# Altium schematic sheet AVR128DB48_Curiosity_Nano_Target_MCU.SchDoc
size A3; SheetTitle: Target MCU; CompanyName: Microchip Technology Inc.; Organization: Microchip Technology; Address1: 2355 West Chandler Blvd.; Address2: Chandler, AZ  85224; Address4: USA; SheetNumber: 2; SheetTotal: 4; Time: Time
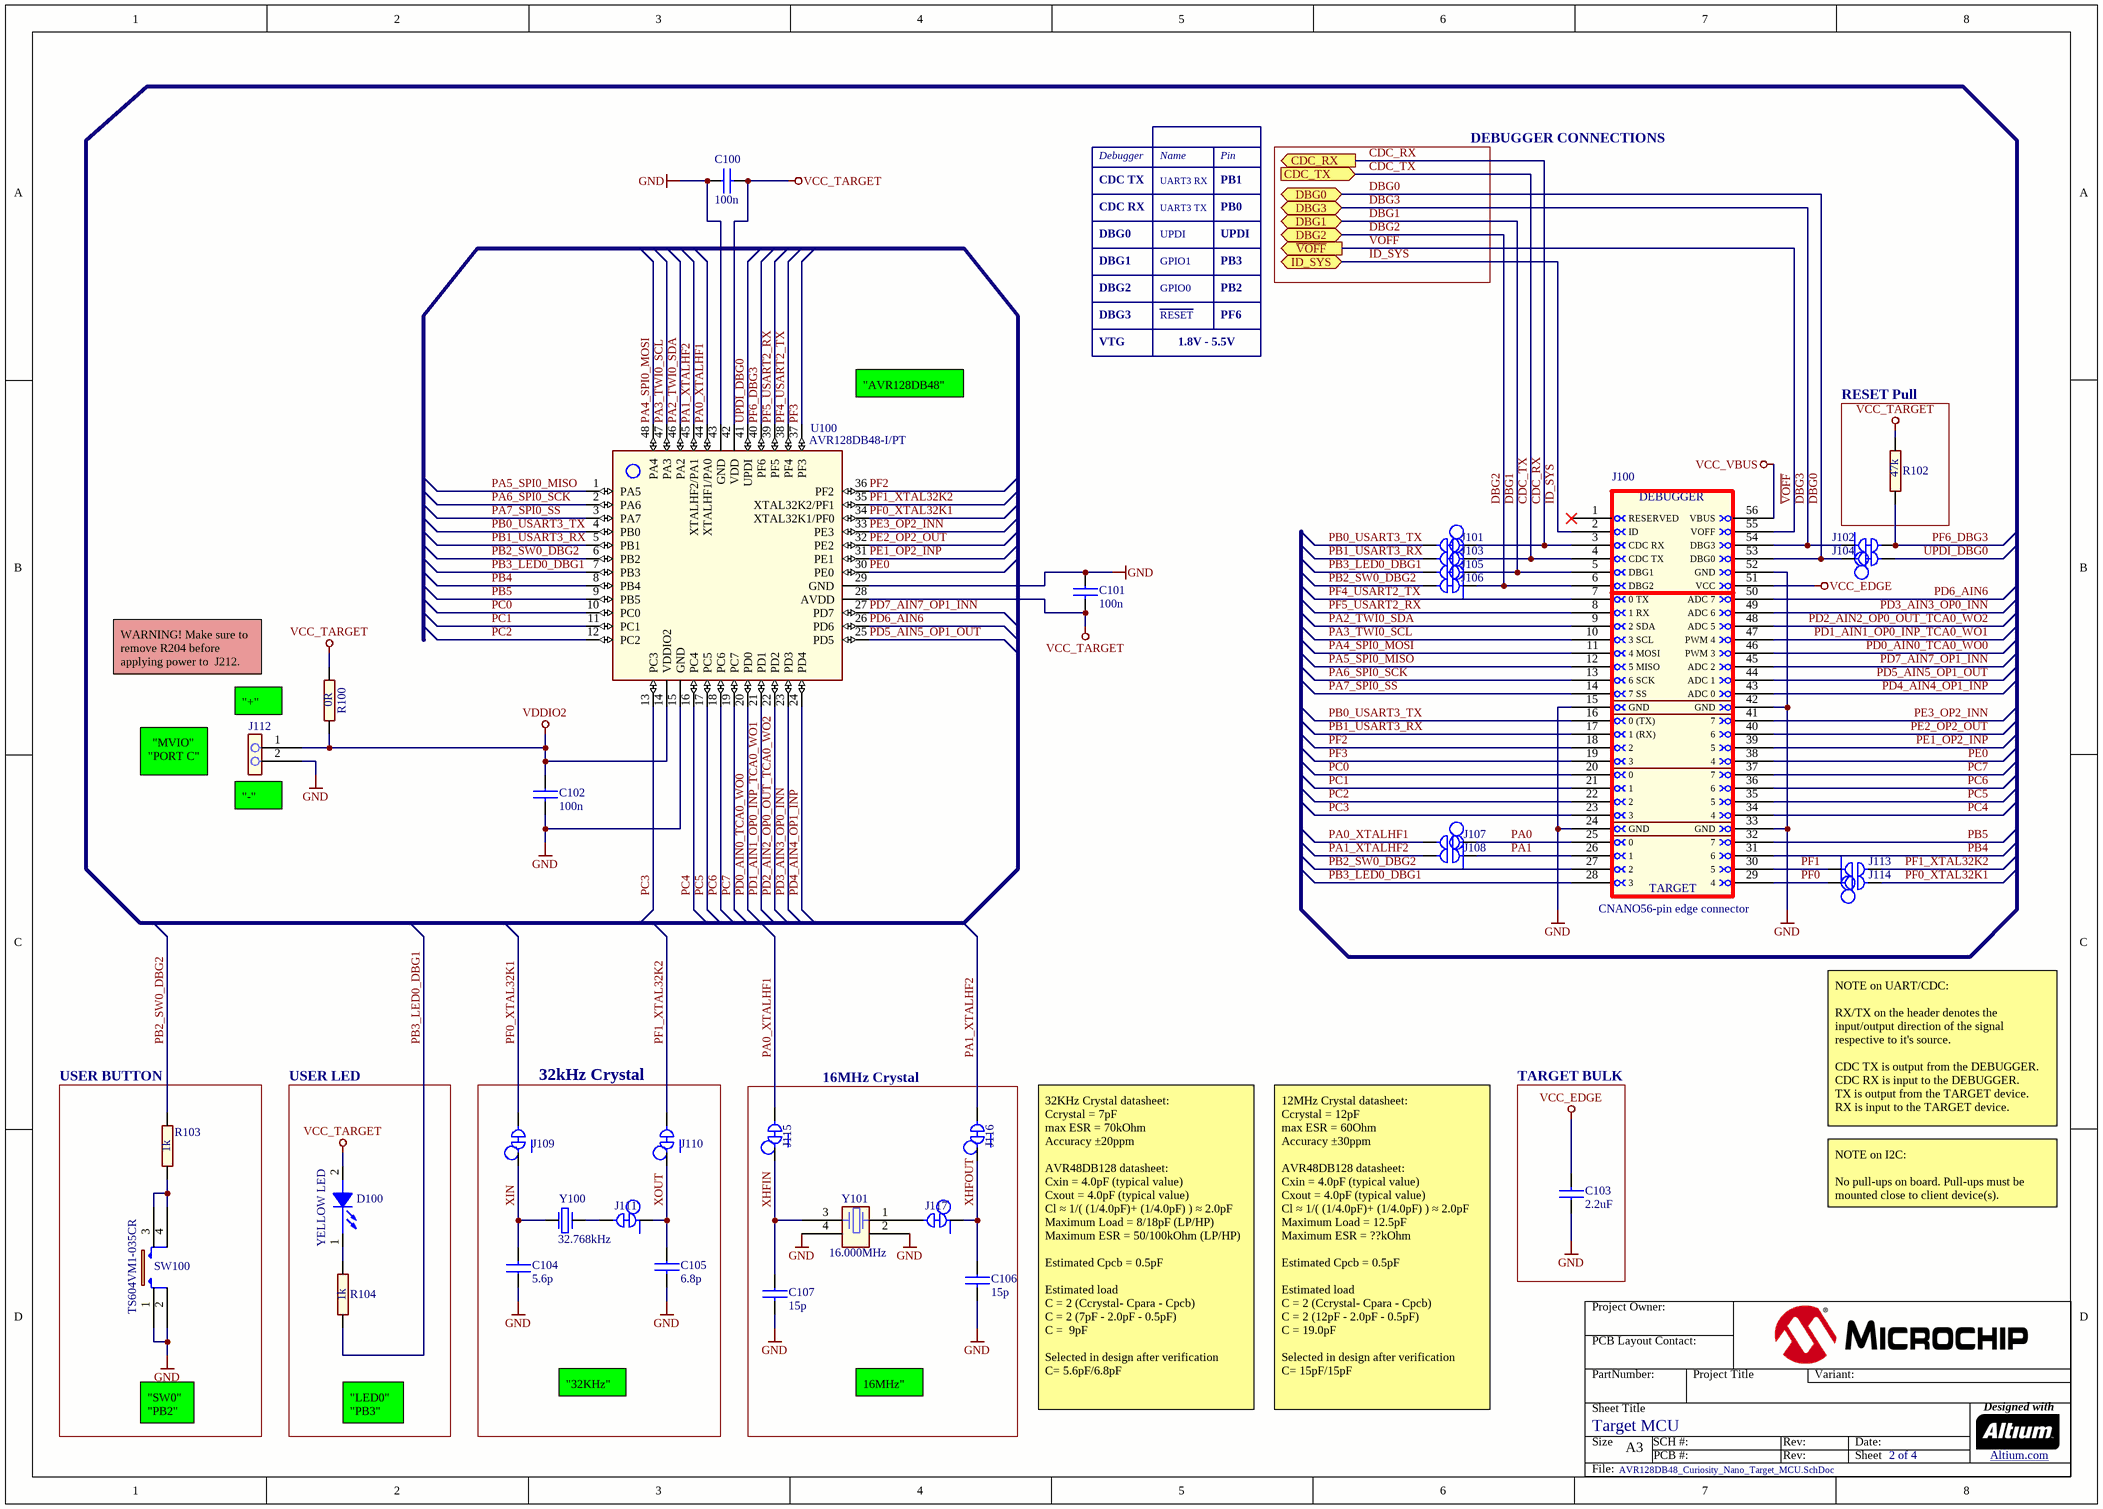
[diagram p0: AVR128DB48_Curiosity_Nano_Target_MCU.SchDoc]

## Parts
C100  value 100n  [AP1-00148]
C101  value 100n  [AP1-00148]
C102  value 100n  [AP1-00148]
C103  value 2.2uF  [AP1-00148]
C104  value 5.6p  [AP1-00148]
C105  value 6.8p  [AP1-00148]
C106  value 15p  [AP1-00148]
C107  value 15p  [AP1-00148]
D100  value YELLOW LED  [AP4-00169]
J100  value CNANO56-pin edge connector  [AP8-01100]  (no BOM)
J101  (no value)  [AP8-01166]  (net tie, no BOM)
J102  (no value)  [AP8-01166]  (net tie, no BOM)
J103  (no value)  [AP8-01166]  (net tie, no BOM)
J104  (no value)  [AP8-01166]  (net tie, no BOM)
J105  (no value)  [AP8-01166]  (net tie, no BOM)
J106  (no value)  [AP8-01166]  (net tie, no BOM)
J107  (no value)  [AP9-00172]  (net tie, no BOM)
J108  (no value)  [AP9-00172]  (net tie, no BOM)
J109  (no value)  [AP8-01166]  (net tie, no BOM)
J110  (no value)  [AP8-01166]  (net tie, no BOM)
J111  (no value)  [AP8-00595]  (net tie, no BOM)
J112  (no value)  [AP8-01074]
J113  (no value)  [AP9-00172]  (net tie, no BOM)
J114  (no value)  [AP9-00172]  (net tie, no BOM)
J115  (no value)  [AP8-01166]  (net tie, no BOM)
J116  (no value)  [AP8-01166]  (net tie, no BOM)
J117  (no value)  [AP8-00595]  (net tie, no BOM)
R100  value 0R  [AP2-00108]
R102  value 47k  [AP2-00108]
R103  value 1k  [AP2-00108]
R104  value 1k  [AP2-00108]
SW100  value TS604VM1-035CR  [AP8-00137]  (hidden comment: Rating: DC 12V 50mA / Max 0.1 ohm contact resistance)
U100  value AVR128DB48-I/PT  [AP6-00357]
Y100  value 32.768kHz  [AP7-00069]
Y101  value 16.000MHz  [AP7-00061]

## Blocks framed on the sheet
RESET Pull: R102
USER BUTTON: R103 SW100
USER LED: D100 R104
32kHz Crystal: C104 C105 J109-J111 Y100
16MHz Crystal: C106 C107 J115-J117 Y101
TARGET BULK: C103

## Ports
CDC_RX (out), CDC_TX (in), DBG0 (bidir), DBG1 (bidir), DBG2 (bidir), DBG3 (bidir), ID_SYS (bidir), ~{VOFF} (out)

## Nets
GND: C100.1 C101.1 C102.2 C103.1 C104.1 C105.2 C106.2 C107.2 J100.15(GND) J100.24(GND) J100.33(GND) J100.42(GND) J100.52(GND) J112.2 SW100.1 SW100.2 U100.15(GND) U100.29(GND) U100.43(GND) Y101.2 Y101.4
VCC_EDGE: C103.2 J100.51(VCC)
VCC_TARGET: C100.2 C101.2 D100.2(ANODE) R100.2 R102.2 U100.28(AVDD) U100.42(VDD)
VCC_VBUS: J100.56(VBUS)
VDDIO2: C102.1 J112.1 R100.1 U100.14(VDDIO2)
CDC_RX: J100.3(CDC_RX) J101.1 ; port CDC_RX
CDC_TX: J100.4(CDC_TX) J103.1 ; port CDC_TX
DBG0: J100.53(DBG0) J104.1 ; port DBG0
DBG1: J100.5(DBG1) J105.1 ; port DBG1
DBG2: J100.6(DBG2) J106.1 ; port DBG2
DBG3: J100.54(DBG3) J102.1 ; port DBG3
ID_SYS: J100.2(ID) ; port ID_SYS
PA0: J100.25(0) J107.1
PA0_XTALHF1: J107.2 J115.2 U100.44(XTALHF1/PA0)
PA1: J100.26(1) J108.1
PA1_XTALHF2: J108.2 J116.2 U100.45(XTALHF2/PA1)
PA2_TWI0_SDA: J100.9(2_SDA) U100.46(PA2)
PA3_TWI0_SCL: J100.10(3_SCL) U100.47(PA3)
PA4_SPI0_MOSI: J100.11(4_MOSI) U100.48(PA4)
PA5_SPI0_MISO: J100.12(5_MISO) U100.1(PA5)
PA6_SPI0_SCK: J100.13(6_SCK) U100.2(PA6)
PA7_SPI0_SS: J100.14(7_SS) U100.3(PA7)
PB0_USART3_TX: J100.16(0_(TX)) J101.2 U100.4(PB0)
PB1_USART3_RX: J100.17(1_(RX)) J103.2 U100.5(PB1)
PB2_SW0_DBG2: J100.27(2) J106.2 R103.1 U100.6(PB2)
PB3_LED0_DBG1: J100.28(3) J105.2 R104.1 U100.7(PB3)
PB4: J100.31(6) U100.8(PB4)
PB5: J100.32(7) U100.9(PB5)
PC0: J100.20(0) U100.10(PC0)
PC1: J100.21(1) U100.11(PC1)
PC2: J100.22(2) U100.12(PC2)
PC3: J100.23(3) U100.13(PC3)
PC4: J100.34(4) U100.16(PC4)
PC5: J100.35(5) U100.17(PC5)
PC6: J100.36(6) U100.18(PC6)
PC7: J100.37(7) U100.19(PC7)
PD0_AIN0_TCA0_WO0: J100.46(PWM_3) U100.20(PD0)
PD1_AIN1_OP0_INP_TCA0_WO1: J100.47(PWM_4) U100.21(PD1)
PD2_AIN2_OP0_OUT_TCA0_WO2: J100.48(ADC_5) U100.22(PD2)
PD3_AIN3_OP0_INN: J100.49(ADC_6) U100.23(PD3)
PD4_AIN4_OP1_INP: J100.43(ADC_0) U100.24(PD4)
PD5_AIN5_OP1_OUT: J100.44(ADC_1) U100.25(PD5)
PD6_AIN6: J100.50(ADC_7) U100.26(PD6)
PD7_AIN7_OP1_INN: J100.45(ADC_2) U100.27(PD7)
PE0: J100.38(4) U100.30(PE0)
PE1_OP2_INP: J100.39(5) U100.31(PE1)
PE2_OP2_OUT: J100.40(6) U100.32(PE2)
PE3_OP2_INN: J100.41(7) U100.33(PE3)
PF0: J100.29(4) J114.1
PF0_XTAL32K1: J109.2 J114.2 U100.34(XTAL32K1/PF0)
PF1: J100.30(5) J113.1
PF1_XTAL32K2: J110.2 J113.2 U100.35(XTAL32K2/PF1)
PF2: J100.18(2) U100.36(PF2)
PF3: J100.19(3) U100.37(PF3)
PF4_USART2_TX: J100.7(0_TX) U100.38(PF4)
PF5_USART2_RX: J100.8(1_RX) U100.39(PF5)
PF6_DBG3: J102.2 R102.1 U100.40(PF6)
UPDI_DBG0: J104.2 U100.41(UPDI)
~{VOFF}: J100.55(VOFF) ; port ~{VOFF}
XHFIN: C107.1 J115.1 Y101.3
XHFOUT: C106.1 J116.1 J117.1
XIN: C104.2 J109.1 Y100.1
XOUT: C105.1 J110.1 J111.1
NetD100_1: D100.1(CATHODE) R104.2
NetJ111_2: J111.2 Y100.2
NetJ117_2: J117.2 Y101.1
NetR103_2: R103.2 SW100.3 SW100.4

Not connected (* = marked no-connect by the designer): J100 1(RESERVED)*

## Notes on the sheet
- Debugger
- CDC TX
- UART3 RX
- Name
- PB1
- Pin
- DEBUGGER CONNECTIONS
- DBG0
- CDC RX
- UPDI
- UART3 TX
- PB0
- DBG1
- DBG2
- DBG3
- GPIO1
- GPIO0
- RESET
- PB3
- PB2
- PF6
- VTG
- 1.8V - 5.5V
- "AVR128DB48"
- WARNING! Make sure to remove R204 before applying power to  J212.
- "+"
- "MVIO"
  "PORT C"
- (near J112) "-"
- NOTE on UART/CDC:
  RX/TX on the header denotes the input/output direction of the signal respective to it's source.
  CDC TX is output from the DEBUGGER.
  CDC RX is input to the DEBUGGER.
  TX is output from the TARGET device.
  RX is input to the TARGET device.
- NOTE on I2C:
  No pull-ups on board. Pull-ups must be mounted close to client device(s).
- "32KHz"
- 16MHz"
- "SW0"
  "PB2"
- "LED0"
  "PB3"
- 32KHz Crystal datasheet:
  Ccrystal = 7pF
  max ESR = 70kOhm
  Accuracy ±20ppm
  AVR48DB128 datasheet:
  Cxin = 4.0pF (typical value)
  Cxout = 4.0pF (typical value)
  Cl ≈ 1/( (1/4.0pF)+ (1/4.0pF) ) ≈ 2.0pF
  Maximum Load = 8/18pF (LP/HP)
  Maximum ESR = 50/100kOhm (LP/HP)
  Estimated Cpcb = 0.5pF
  Estimated load
  C = 2 (Ccrystal- Cpara - Cpcb)
  C = 2 (7pF - 2.0pF - 0.5pF)
  C =  9pF
  Selected in design after verification
  C= 5.6pF/6.8pF
- 12MHz Crystal datasheet:
  Ccrystal = 12pF
  max ESR = 60Ohm
  Accuracy ±30ppm
  AVR48DB128 datasheet:
  Cxin = 4.0pF (typical value)
  Cxout = 4.0pF (typical value)
  Cl ≈ 1/( (1/4.0pF)+ (1/4.0pF) ) ≈ 2.0pF
  Maximum Load = 12.5pF
  Maximum ESR = ??kOhm
  Estimated Cpcb = 0.5pF
  Estimated load
  C = 2 (Ccrystal- Cpara - Cpcb)
  C = 2 (12pF - 2.0pF - 0.5pF)
  C = 19.0pF
  Selected in design after verification
  C= 15pF/15pF
- Project Owner:
- PCB Layout Contact:
- PartNumber:
- Project Title
- Variant:
- Sheet Title
- Size
- A3
- SCH #:
- PCB #:
- Rev:
- Date:
- Sheet
- Designed with
- Altium.com <http://go.altium.com/MicrochipLandingPage_Evaluation.html>
- File:
- (in symbol A08-2840) DEBUGGER; TARGET

## Library data of the parts
C100-C102 = A01-0246: Ceramic capacitor, SMD 0402, X7R, 16V, +/-10%; Manufacturer: Yageo; MPN: CC0402KRX7R7BB104; PartGroup: Capacitors,Ceramic,SMD 0402; TemperatureRange: -55 - +125 deg C; AN: A01-0246; Height: 0.5; Tolerance: 16V, +/-10%
C103 = A01-0493: CAP CER 2.2UF 10V 10% X5R 0402; PartGroup: Capacitors,Ceramic,SMD 0402; Manufacturer: TDK; MPN: C1005X5R1A225K050BC; Tolerance: +/-10%; TemperatureRange: -55 to 85C; AN: A01-0493; Height: 0.5
C104 = A01-0012: Ceramic capacitor, SMD 0402, NP0, 50V, +/-5%; PartGroup: Capacitors,Ceramic,SMD 0402; Manufacturer: Yageo; MPN: CC0402DRNPO9BN5R6; TemperatureRange: -55 - +125 deg C; Tolerance: 50V, +/-5%; AN: A01-0012; Height: 0.550000011920929
C105 = A01-0013: Ceramic capacitor, SMD 0402, NP0, 50V, +/-5%; PartGroup: Capacitors,Ceramic,SMD 0402; Manufacturer: Yageo; MPN: CC0402CRNPO9BN6R8; TemperatureRange: -55 - +125 deg C; Tolerance: 50V, +/-5%; AN: A01-0013; Height: 0.550000011920929
C106 C107 = A01-0017: Ceramic capacitor, SMD 0402, NP0, 50V, +/-5%; PartGroup: Capacitors,Ceramic,SMD 0402; Manufacturer: Yageo; MPN: CC0402JRNPO9BN150; TemperatureRange: -55 - +125 deg C; AN: A01-0017; Height: 0.550000011920929; Tolerance: 50V, +/-5%
D100 = A10-0218: LED, SMD 0603, Yellow, Wave length=590nm, 100mcd @ (20mA, 2.2Vf) rohm; PartGroup: Opto,LEDs,SMD; MPN: SML-D12Y1WT86; TemperatureRange: -40 to +85; AN: A10-0218; Height: 0.550000011920929; Manufacturer: ROHM
J100 = A08-2840: Curiosity Nano 56-pin edge connector with castellations, 100-mil pitch.; PartGroup: Mechanical devices,Connectors,Pin headers; AN: A08-2840
J101-J106 J109 J110 J115 J116 = A08-2981: Closed Link 0402 w/50mil hole; PartGroup: Mechanical devices,PCB implemented components; Value: Closed Link; AN: A08-2981
J107 J108 J113 J114 = A08-2866: 1x1mm, Round Strap, Open, no frame; PartGroup: Mechanical devices,PCB implemented components; Value: SOLDER-STRAP_OPEN; AN: A08-2866; Height: 0
J111 J117 = A08-1454: Closed Link 0402; PartGroup: Mechanical devices,PCB implemented components; Value: Closed Link; AN: A08-1454
J112 = A08-2782: 1x2 pin header, 2.54mm pitch, Pin-in-Paste THM; PartGroup: Mechanical devices,Connectors,Pin headers; Manufacturer: Cabcon A/S; MPN: 1125-1102S0S113CR01; Value: 1125-1102S0S113R1; TemperatureRange: -40Â°C to +105Â°C; AN: A08-2782; Height: 9
R100 = A02-0163: RES 0.0 OHM 1/16W 0402 SMD; PartGroup: Resistors,SMD,0402 1%; Manufacturer: Yageo; MPN: RC0402JR-070RL; Tolerance: 1 %; TemperatureRange: -55 - +125 deg C; AN: A02-0163; Height: 0.349999994039536
R102 = A02-0252: Thick film resistor, SMD 0402, 1/16W, 1%; PartGroup: Resistors,SMD,0402 1%; Manufacturer: KOA; MPN: RK73H1ETTP4702F; TemperatureRange: -55 - +125 deg C; Tolerance: 1 %; AN: A02-0252; Height: 0.349999994039536
R103 R104 = A02-0212: Thick film resistor, SMD 0402, 1/16W, 1%; PartGroup: Resistors,SMD,0402 1%; Manufacturer: Yageo; MPN: RC0402FR071KL; TemperatureRange: -55 - +125 deg C; Tolerance: 1 %; AN: A02-0212; Height: 0.349999994039536
SW100 = A08-2830: SWITCH, SMD, 260gf, 6.4mm X 6.2mm; PartGroup: Mechanical devices,Switches,SMD; Manufacturer: Dailywell Electronics Co.LTD; MPN: TS604VM1-035CR-R; TemperatureRange: -40 - +85 deg C; AN: A08-2830; Height: 3.5
U100 = A06-1718: AVR MCU 8-Bit 128kB Flash 48 pin 24MHz TQFP; PartGroup: Integrated Circuits,MCU, MPU, DSP,AVR MCU; Manufacturer: Microchip; MPN: AVR128DB48T-I/PT; AN: A06-1718
Y100 = A07-0189: Crystal, 32.768kHz, CL=7.0pF, ESR=70kOhm, SMD  LxW=3.2 x 1.5mm, 20ppm; PartGroup: Frequency devices,Crystals,SMD; Manufacturer: Microchip; MPN: VMK3-9002-32K7680000TR; AN: A07-0189; Height: 0.899999976158142
Y101 = A07-0175: Crystal, 16.0MHz, CL=12.0pF, ESR=80Ohm, SMD  LxW=3.2 x 25mm, 20ppm; PartGroup: Frequency devices,Crystals,SMD; Manufacturer: Microchip; MPN: VXM7-9040-16M0000000TR; TemperatureRange: -55 degC to +125 degC; AN: A07-0175; Tolerance: 20ppm; Height: 0.800000011920929